# Altium schematic sheet Main_Clean.SchDoc
size A4; SheetNumber: 1; SheetTotal: 3
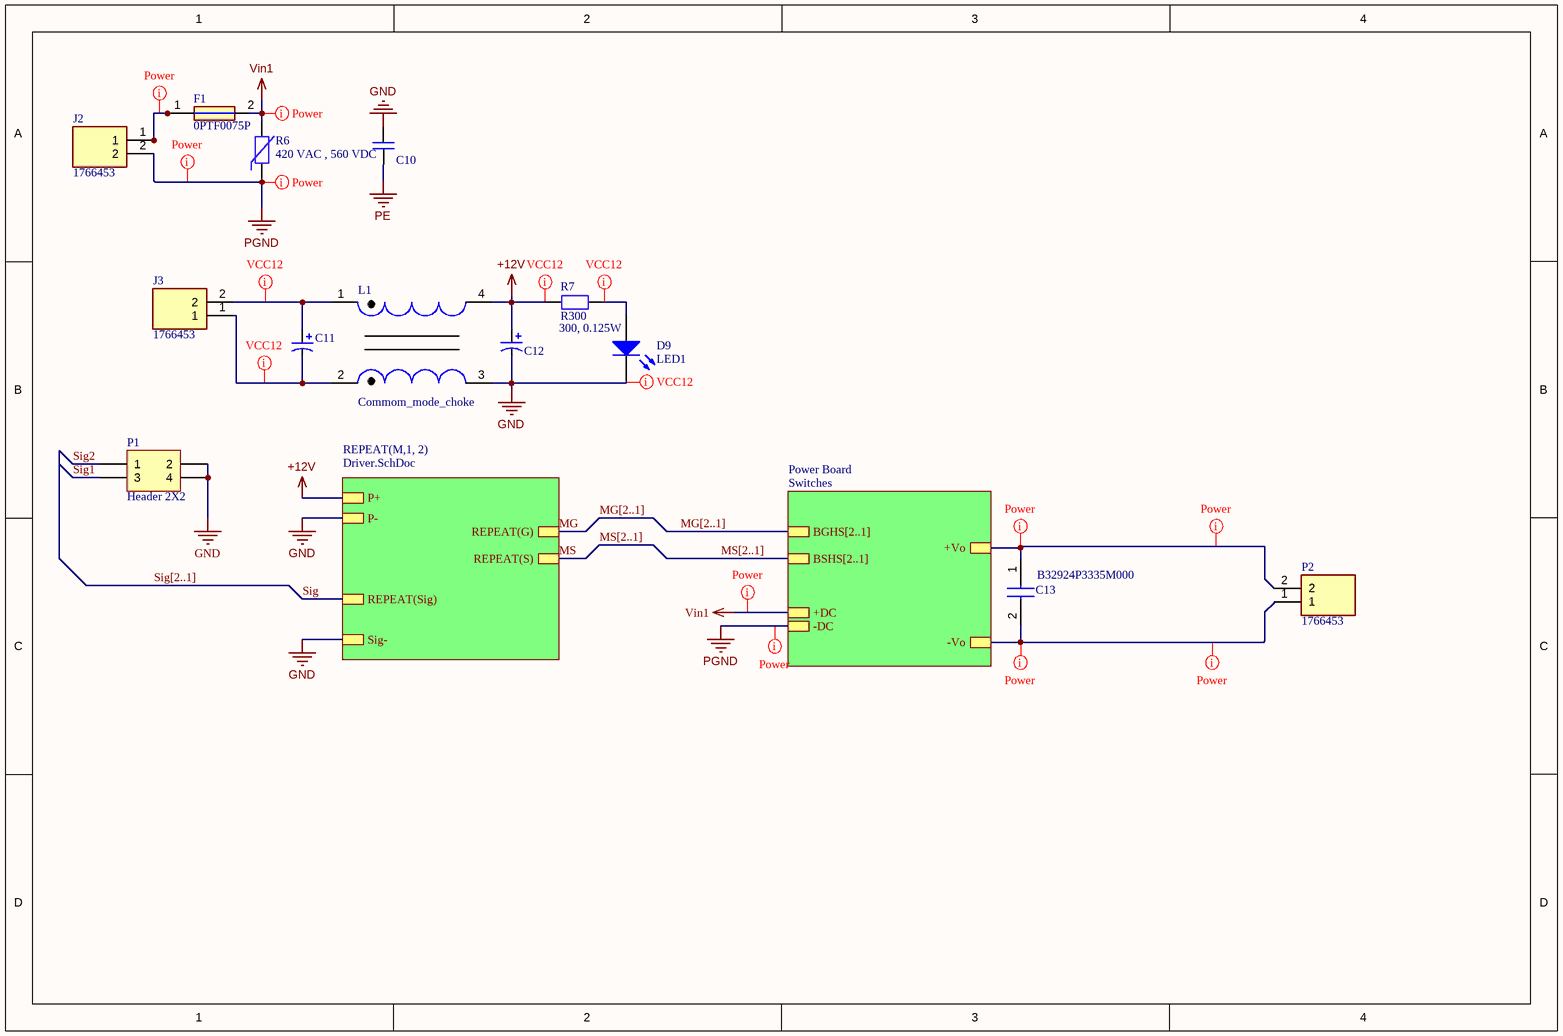
[diagram p0: Main_Clean.SchDoc]

## Parts
C10  Cer_large  [CAPC3227X25N]  (value not drawn)
C11  NACEW102M25V12.5X14  [Cap_pol]  (value not drawn)
C12  NACEW102M25V12.5X14  [Cap_pol]  (value not drawn)
C13  B32924P3335M000  [B32924P_(31.5_x_18)]
D9  LED1  [0805_LED]
F1  0PTF0075P  [0PTF0075P]
J2  1766453  [1766453]
J3  1766453  [1766453]
L1  Commom_mode_choke  [Common_mode]
P1  Header 2X2  [HDR2X2]
P2  1766453  [1766453]
R6  420 VAC , 560 VDC  [AXIAL-0.3]
R7  R300  value 300, 0.125W  [1206_SMD 2]

## Sub-sheets
Power Board = Switches: +DC, -DC, BGHS[2..1], BSHS[2..1], +Vo, -Vo
REPEAT(M,1, 2) = Driver.SchDoc: REPEAT(G), REPEAT(S), Sig-, REPEAT(Sig), P-, P+

## Nets
+12V: C12.1 L1.4 R7.1 ; sheet REPEAT(M,1, 2)/P+
GND: C10.1 C12.2 D9.2(K) L1.3 P1.2 P1.4 ; sheet REPEAT(M,1, 2)/Sig-, sheet REPEAT(M,1, 2)/P-
PE: C10.2
PGND: J2.2 R6.1 ; sheet Power Board/-DC
Vin1: F1.2 R6.2 ; sheet Power Board/+DC
MG: sheet REPEAT(M,1, 2)/REPEAT(G)
MS: sheet REPEAT(M,1, 2)/REPEAT(S)
Sig: sheet REPEAT(M,1, 2)/REPEAT(Sig)
Sig1: P1.3
Sig2: P1.1
NetC11_1: C11.1 J3.2 L1.1
NetC11_2: C11.2 J3.1 L1.2
NetC13_1: C13.1 P2.2 ; sheet Power Board/+Vo
NetC13_2: C13.2 P2.1 ; sheet Power Board/-Vo
NetD9_1: D9.1(A) R7.2
NetF1_1: F1.1 J2.1

## Buses and harness runs
bus MG[2..1]
bus MG[2..1] = sheet Power Board/BGHS[2..1]
bus MS[2..1]
bus MS[2..1] = sheet Power Board/BSHS[2..1]
bus Sig[2..1]

## Layout directives
net class Power: NetC13_1, NetC13_2, NetF1_1, PGND, Vin1
net class +12: +12V, GND, NetC11_1, NetC11_2, NetD9_1

## Notes on the sheet
- DWG. NO.
- REV.
- SHT.
- REVISION
- DESCRIPTION
- DATE
- APPROVED
- THIS DOCUMENT AND THE DATA DISCLOSED HEREIN OR HEREWITH IS THE PROPERTY OF ALTIUM LIMITED AND MAY BE FREELY DISTRIBUTED IN WHOLE. NO RIGHTS ARE RESERVED OR EXPRESS OR IMPLIED WARANTEE GIVEN.
- ENG:
- DSN:
- APPROVALS
- PROJECT
- DOCUMENT REVISION:
- DESIGN ITEM:
- CHK:
- BOM:
- REFERENCE DOCUMENTS
- PROJECT REVISION:
- TITLE
- FAB DWG:
- PCB DWG:
- ASSY DWG:
- SCALE:
- SIZE
- C
- CAGE CODE
- FILE NAME
- DWG NO.
- SHEET
- OF
- REV

## Library data of the parts
C10 = Cer_large: Order code: 1759466; Value: 22mkF; Type: 16V; Supplier: Farnel; Price: 0.407; Package: 1210
C11 C12 = NACEW102M25V12.5X14: Value: 1 mF; Type: 25V; Order code: 16731346; Supplier: Elfa; Price: 3,28
C13 = B32924P3335M000: Capacitor; Manufacturer_Name: TDK; Datasheet Link: https://product.tdk.com/system/files/dam/doc/product/capacitor/film/emi/data_sheet/x2_b32922_924_p_q.pdf; Height: 33mm; Manufacturer_Part_Number: B32924P3335M000; Mouser Part Number: 871-B32924P3335M000; Mouser Price/Stock: https://www.mouser.co.uk/ProductDetail/EPCOS-TDK/B32924P3335M000?qs=KUoIvG%2F9IlY7%252B78GbxRzbA%3D%3D
D9 = LED1: Typical RED GaAs LED; pin to pad: 1>A 2>K; Published: 8-Jun-2000; LatestRevisionDate: 08-Jul-2005; LatestRevisionNote: Mech Layer 1 removed.; PackageReference: LED-1; Publisher: Altium Limited; PackageDescription: LED; 2 Leads
F1 = 0PTF0075P: Fuse; Manufacturer_Name: LITTELFUSE; Datasheet Link: https://media.digikey.com/pdf/Data%20Sheets/Littelfuse%20PDFs/0PTF0075P_Dwg.pdf; Height: 11.5mm; Manufacturer_Part_Number: 0PTF0075P; Mouser Part Number: 576-0PTF0075P; Mouser Price/Stock: https://www.mouser.co.uk/ProductDetail/Littelfuse/0PTF0075P?qs=gu7KAQ731UQYbEqVl9aylw%3D%3D; Arrow Part Number: 0PTF0075P; Arrow Price/Stock: https://www.arrow.com/en/products/0ptf0075p/littelfuse?region=europe
J2 J3 P2 = 1766453: Connector; Manufacturer_Name: Phoenix Contact; Datasheet Link: http://www.phoenixcontact.com/de/produkte/1766453/pdf; Height: 12mm; Manufacturer_Part_Number: 1766453; Mouser Part Number: 651-1766453; Mouser Price/Stock: https://www.mouser.co.uk/ProductDetail/Phoenix-Contact/1766453?qs=s6DiDDoRpTbteEwY3ZEIDg%3D%3D
L1 = Commom_mode_choke: Manufacturer: Wьrth Elektronik; Type: Common mode choke; Value: 20 mH 0.5 A; Order code: 15857854; Supplier: Elfa; Package: Trough_hole; Price: 4,54
P1 = Header 2X2: Header, 2-Pin, Dual row; LatestRevisionDate: 17-Jul-2002; LatestRevisionNote: Re-released for DXP Platform.; Publisher: Altium Limited
R6 = Var_V420LA10P: 420 VAC , 560 VDC, Varistor; Manufacturer: EPCOS; PartNumber: B72207S0461K101; Order code: 871-B72207S461K101; Type: Varistors; Supplier: Mouser; Price: 0,432; Package: 48X8X6 mm; Supplier 1: Mouser; Supplier Part Number 1: 871-B72207S461K101; Value: 420 VAC , 560 VDC
R7 = R300: Type: 16V, 1%; Package: smd 2010; Price: *; Supplier: *; Order code: *; Manufacturer: *